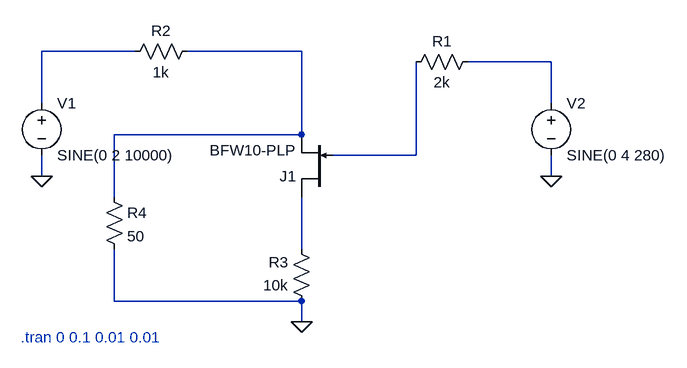
[diagram p0: schematic AMModulation.asc]
AMModulation.asc, the LTspice schematic file:
Version 4
SHEET 1 880 680
WIRE -112 64 -256 64
WIRE 144 64 -32 64
WIRE 528 80 400 80
WIRE -256 144 -256 64
WIRE 528 144 528 80
WIRE 144 192 144 64
WIRE 144 192 -144 192
WIRE 320 224 320 80
WIRE 320 224 192 224
WIRE -256 256 -256 224
WIRE 528 256 528 224
WIRE -144 288 -144 192
WIRE 144 368 144 288
WIRE -144 448 -144 368
WIRE 144 448 -144 448
WIRE 144 480 144 448
FLAG 144 480 0
FLAG -256 256 0
FLAG 528 256 0
SYMBOL njf 192 288 R180
SYMATTR InstName J1
SYMATTR Value BFW10-PLP
SYMBOL res 416 64 R90
WINDOW 0 0 56 VBottom 2
WINDOW 3 32 56 VTop 2
SYMATTR InstName R1
SYMATTR Value 2k
SYMBOL res -16 48 R90
WINDOW 0 0 56 VBottom 2
WINDOW 3 32 56 VTop 2
SYMATTR InstName R2
SYMATTR Value 1k
SYMBOL res 160 464 R180
WINDOW 0 36 76 Left 2
WINDOW 3 36 40 Left 2
SYMATTR InstName R3
SYMATTR Value 10k
SYMBOL voltage -256 128 R0
WINDOW 123 0 0 Left 0
WINDOW 39 0 0 Left 0
SYMATTR InstName V1
SYMATTR Value SINE(0 2 10000)
SYMBOL res -160 272 R0
SYMATTR InstName R4
SYMATTR Value 50
SYMBOL voltage 528 128 R0
WINDOW 123 0 0 Left 0
WINDOW 39 0 0 Left 0
SYMATTR InstName V2
SYMATTR Value SINE(0 4 280)
TEXT -288 504 Left 2 ;.tran 0 0.1 0.01 0.01

The netlist it stands for:
* AMModulation.asc
J1 N005 N004 N002 BFW10-PLP
R1 N003 N004 2k
R2 N002 N001 1k
R3 0 N005 10k
V1 N001 0 SINE(0 2 10000)
R4 N002 0 50
V2 N003 0 SINE(0 4 280)
.model NJF NJF
.model PJF PJF
.lib standard.jft
* .tran 0 0.1 0.01 0.01
.backanno
.end